# EAGLE design Esquema (EAGLE 9.6.2)
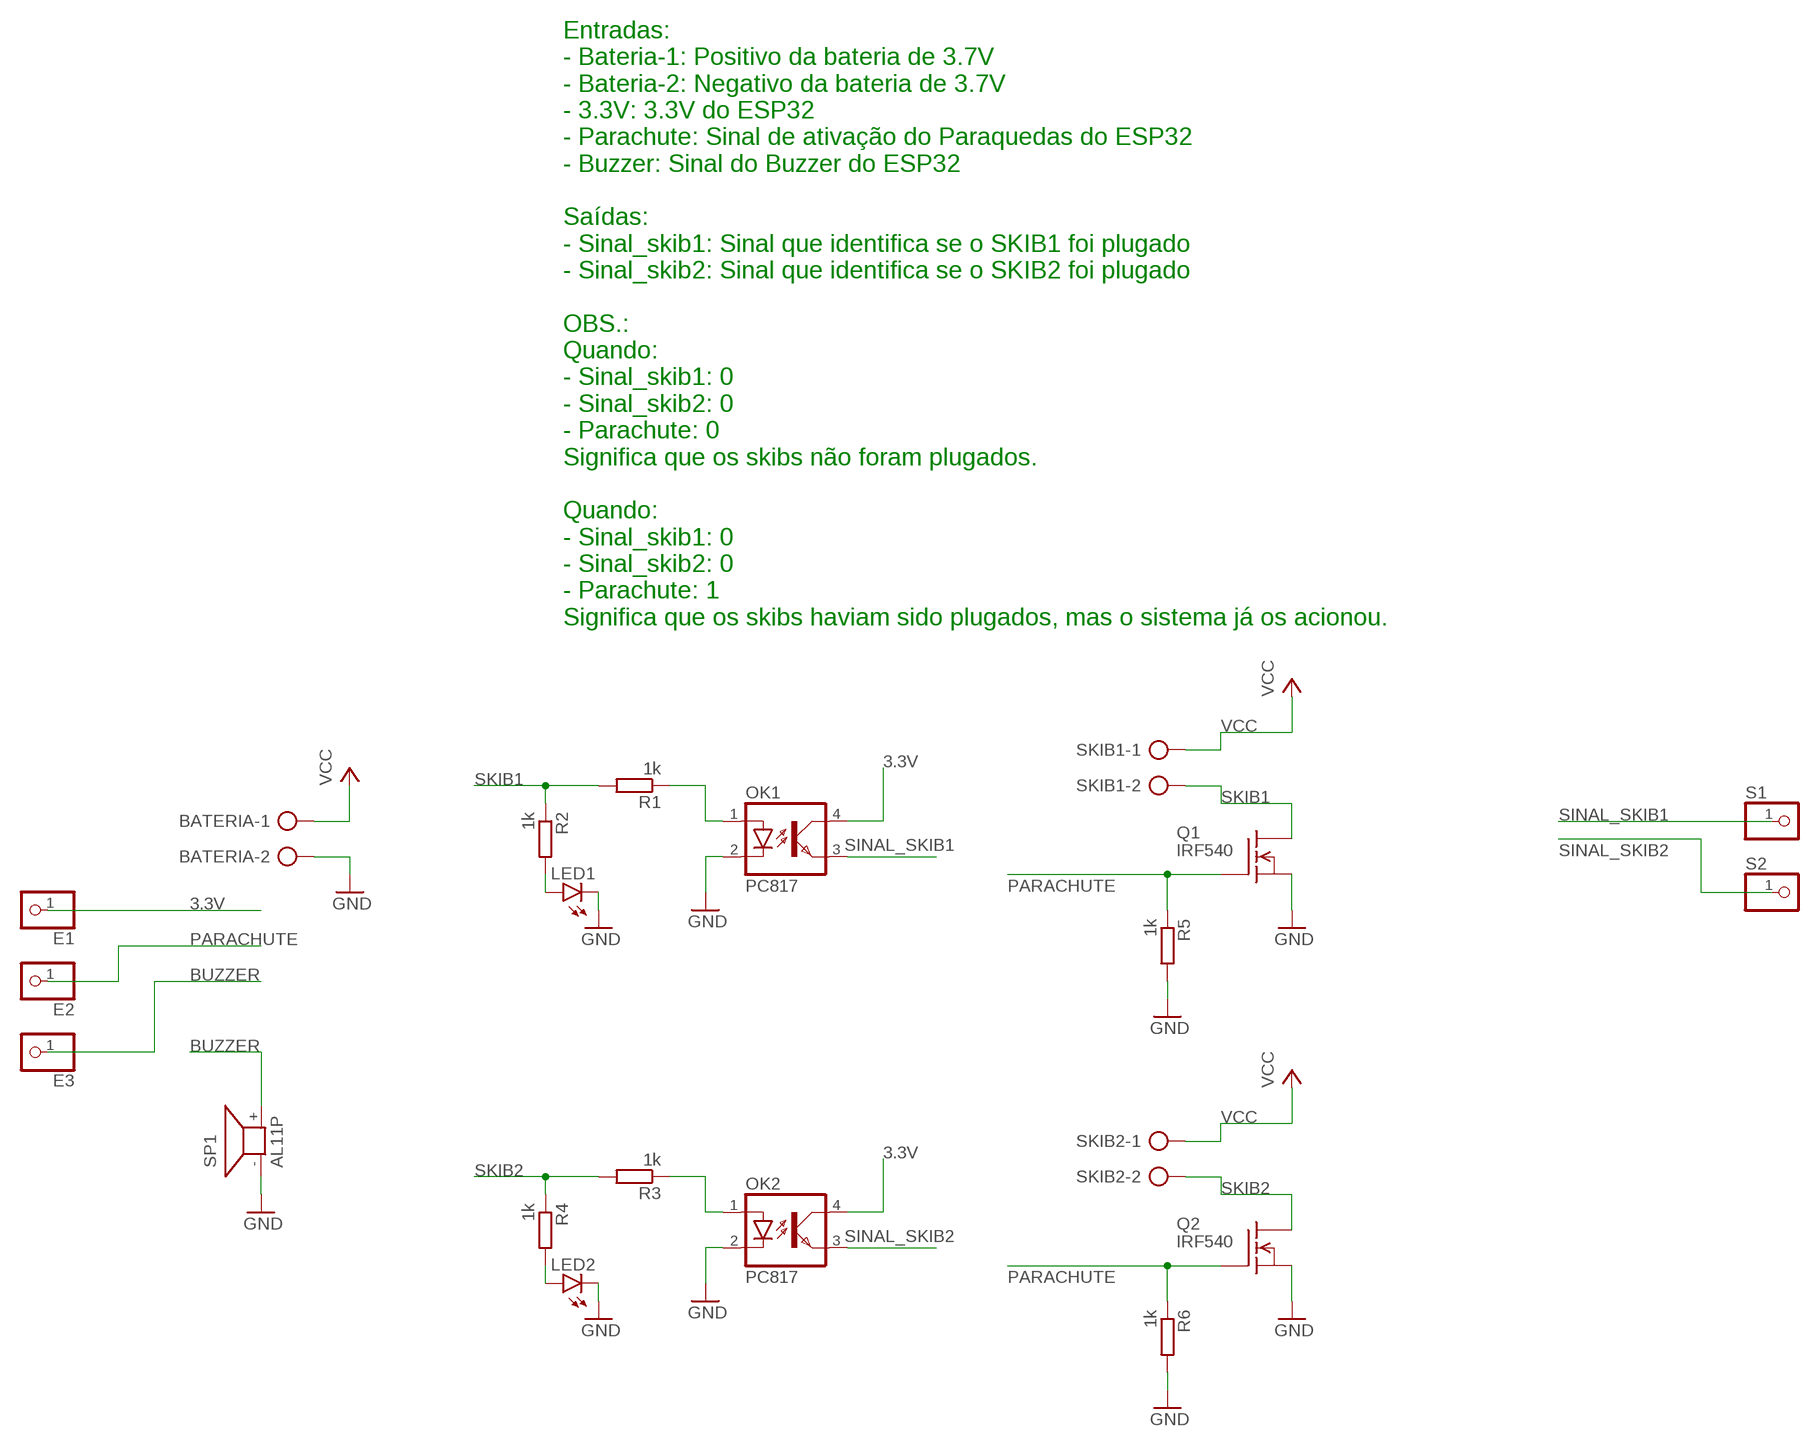
[diagram p0: schematic, sheet 1]

## Parts
BATERIA  AK500/2-H  [AK500/2-H]
E1  PINHD-1X1  [1X01]
E2  PINHD-1X1  [1X01]
E3  PINHD-1X1  [1X01]
LED1  LED5MM  [LED5MM]
LED2  LED5MM  [LED5MM]
OK1  PC817  [DIL04]
OK2  PC817  [DIL04]
Q1  IRF540  [TO220]
Q2  IRF540  [TO220]
R1  1k  R-EU_0207/10  [0207/10]
R2  1k  R-EU_0207/10  [0207/10]
R3  1k  R-EU_0207/10  [0207/10]
R4  1k  R-EU_0207/10  [0207/10]
R5  1k  R-EU_0207/10  [0207/10]
R6  1k  R-EU_0207/10  [0207/10]
S1  PINHD-1X1  [1X01]
S2  PINHD-1X1  [1X01]
SKIB1  AK500/2-H  [AK500/2-H]
SKIB2  AK500/2-H  [AK500/2-H]
SP1  AL11P  [AL11P]

## Nets
3.3V: E1.1 OK1.4(COL) OK2.4(COL)
BUZZER: E3.1 SP1.+
GND: BATERIA.2 LED1.K(C) LED2.K(C) OK1.2(C) OK2.2(C) Q1.3(S) Q2.3(S) R5.2 R6.2 SP1.-
N$1: OK1.1(A) R1.1
N$2: OK2.1(A) R3.1
N$3: LED2.A R4.2
N$4: LED1.A R2.2
PARACHUTE: E2.1 Q1.1(G) Q2.1(G) R5.1 R6.1
SINAL_SKIB1: OK1.3(EMIT) S1.1
SINAL_SKIB2: OK2.3(EMIT) S2.1
SKIB1: Q1.2(D) R1.2 R2.1 SKIB1.2
SKIB2: Q2.2(D) R3.2 R4.1 SKIB2.2
VCC: BATERIA.1 SKIB1.1 SKIB2.1

## Notes on the sheet
- Entradas:
  - Bateria-1: Positivo da bateria de 3.7V
  - Bateria-2: Negativo da bateria de 3.7V
  - 3.3V: 3.3V do ESP32
  - Parachute: Sinal de ativação do Paraquedas do ESP32
  - Buzzer: Sinal do Buzzer do ESP32
  
  Saídas:
  - Sinal_skib1: Sinal que identifica se o SKIB1 foi plugado
  - Sinal_skib2: Sinal que identifica se o SKIB2 foi plugado
  
  OBS.:
  Quando:
  - Sinal_skib1: 0
  - Sinal_skib2: 0
  - Parachute: 0
  Significa que os skibs não foram plugados.
  
  Quando:
  - Sinal_skib1: 0
  - Sinal_skib2: 0
  - Parachute: 1
  Significa que os skibs haviam sido plugados, mas o sistema já os acionou.

## Library data of the parts
BATERIA SKIB1 SKIB2 = con-ptr500:AK500/2-H: CONNECTOR Aug. 2004 / PTR Meßtechnik: Die Bezeichnung der Serie AK505 wurde geändert. Es handelt sich hierbei um AK500 in horizontaler Ausführung.; OC_FARNELL: unknown; OC_NEWARK: unknown
E1-E3 S1 S2 = pinhead:PINHD-1X1: PIN HEADER
LED1 LED2 = led:LED: LED OSRAM: - CHIPLED LG R971, LG N971, LY N971, LG Q971, LY Q971, LO R971, LY R971 LH N974, LH R974 LS Q976, LO Q976, LY Q976 LO Q996 - Hyper CHIPLED LW Q18S LB Q993, LB Q99A, LB R99A - SideLED LS A670, LO A670, LY A670, LG A670, LP A670 LB A673, LV A673, LT A673, LW A673 LH A674 LY A675 LS A676, LA A676, LO A676, LY A676, LW A676 LS A679, LY A679, LG A679 - Hyper Micro SIDELED® LS Y876, LA Y876, LO Y876, LY Y876 LT Y87S - SmartLED LW L88C, LW L88S LB L89C, LB L89S, LG L890 LS L89K, LO L89K, LY L89K LS L896, LA L896, LO L896, LY L896 - TOPLED LS T670, LO T670, LY T670, LG T670, LP T670 LSG T670, LSP T670, LSY T670, LOP T670, LYG T670 LG T671, LOG T671, LSG T671 LB T673, LV T673, LT T673, LW T673 LH T674 LS T676, LA T676, LO T676, LY T676, LB T676, LH T676, LSB T676, LW T676 LB T67C, LV T67C, LT T67C, LS T67K, LO T67K, LY T67K, LW E67C LS E67B, LA E67B, LO E67B, LY E67B, LB E67C, LV E67C, LT E67C LW T67C LS T679, LY T679, LG T679 LS T770, LO T770, LY T770, LG T770, LP T770 LB T773, LV T773, LT T773, LW T773 LH T774 LS E675, LA E675, LY E675, LS T675 LS T776, LA T776, LO T776, LY T776, LB T776 LHGB T686 LT T68C, LB T68C - Hyper Mini TOPLED® LB M676 - Mini TOPLED Santana® LG M470 LS M47K, LO M47K, LY M47K Source: http://www.osram.convergy.de LUXEON: - LUMILED® LXK2-PW12-R00, LXK2-PW12-S00, LXK2-PW14-U00, LXK2-PW14-V00 LXK2-PM12-R00, LXK2-PM12-S00, LXK2-PM14-U00 LXK2-PE12-Q00, LXK2-PE12-R00, LXK2-PE12-S00, LXK2-PE14-T00, LXK2-PE14-U00 LXK2-PB12-K00, LXK2-PB12-L00, LXK2-PB12-M00, LXK2-PB14-N00, LXK2-PB14-P00, LXK2-PB14-Q00 LXK2-PR12-L00, LXK2-PR12-M00, LXK2-PR14-Q00, LXK2-PR14-R00 LXK2-PD12-Q00, LXK2-PD12-R00, LXK2-PD12-S00 LXK2-PH12-R00, LXK2-PH12-S00 LXK2-PL12-P00, LXK2-PL12-Q00, LXK2-PL12-R00 Source: www.luxeon.com KINGBRIGHT: KA-3528ASYC Source: www.kingbright.com
OK1 OK2 = optocoupler:PC817: SHARP OPTO COUPLER; MPN: PC817X4J000F; OC_FARNELL: 9707727; OC_NEWARK: 97K7059
Q1 Q2 = transistor-fet:IRF540: N-Channel Enhancement MOSFET (HEXFET); 100V; 28A; 0,077Ohm
R1-R6 = rcl:R-EU_: RESISTOR, European symbol; SPICEPREFIX: R
SP1 = buzzer:AL11P: SPEAKER Source: Buerklin; OC_FARNELL: unknown; OC_NEWARK: unknown

## Board
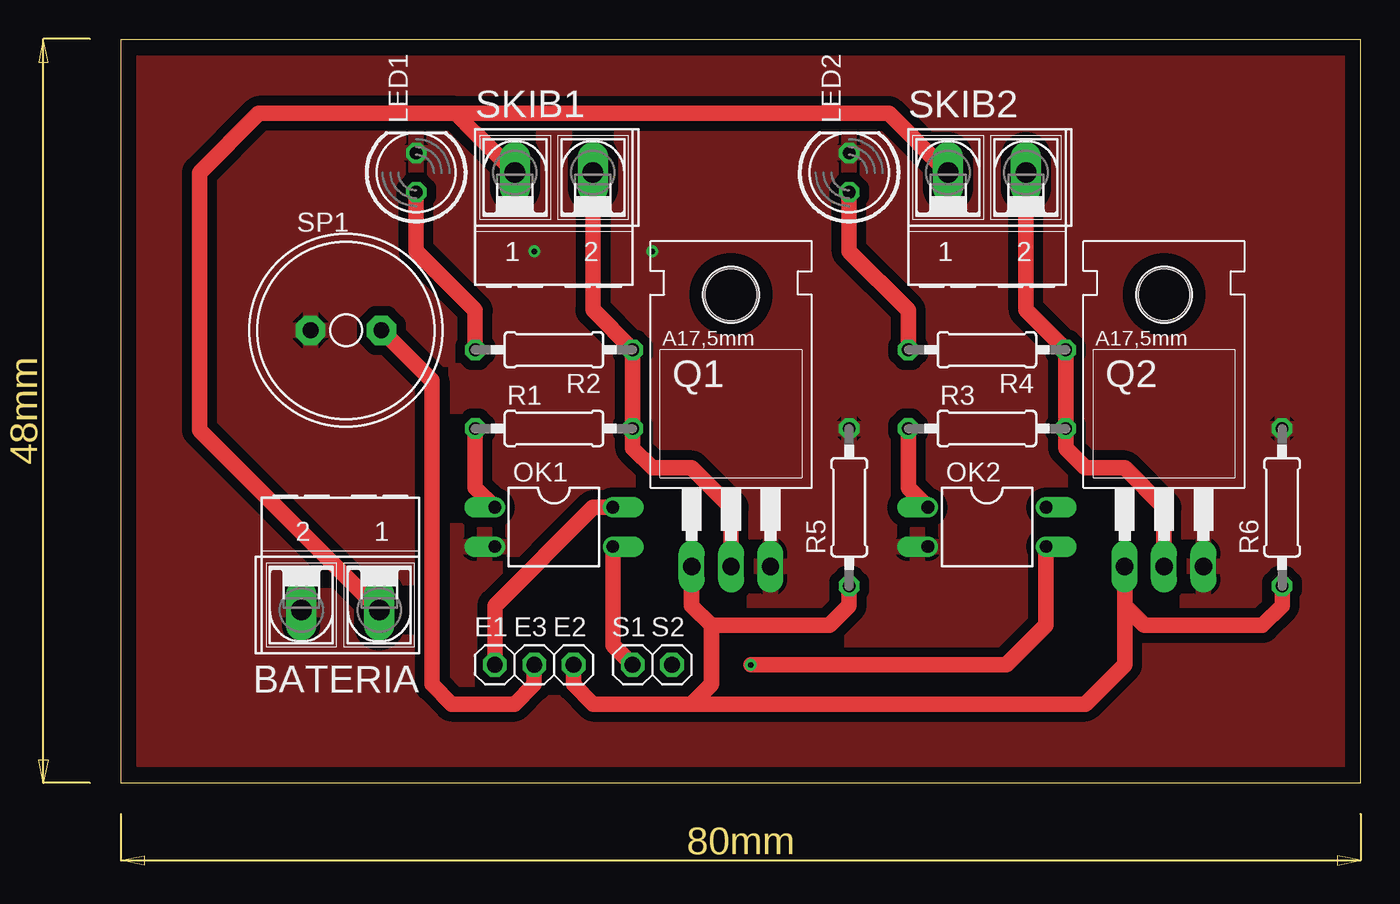
[diagram p1: board, top side]
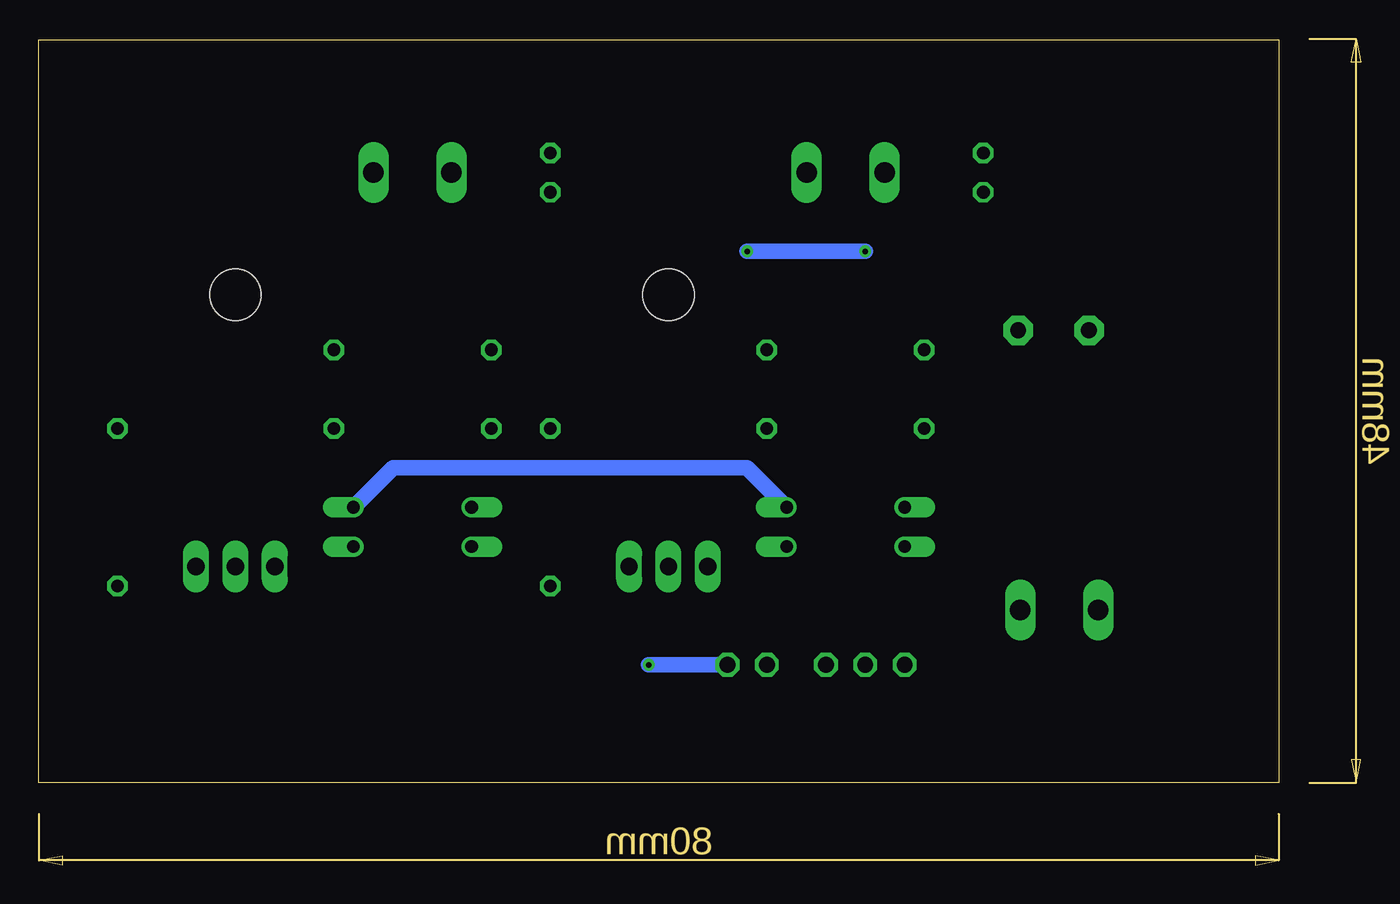
[diagram p2: board, bottom side, seen from below]

Size 79.99 x 47.93 mm. Coordinates in mm from the lower left corner, seen from the top.
Outline: 0,0 79.99,0 79.99,47.93 0,47.93 0,0
Copper layers (1*16): Top 0.035mm / dielectric 1.5mm / Bottom 0.035mm
Design rules "default *": minimum track width 1mm, minimum drill 0.35mm, track to track 25mil, track to pad 0.5mm, pad to pad 6mil, via to via 6mil, smd to smd 6mil, copper to edge 40mil, drill to drill 6mil, minimum pad ring 10mil, minimum via ring 8mil, stop-mask expansion 4mil, vias tented up to drill 0mil, thermal gap 10mil

### Footprints (pad centres in the part's own frame; a part is rotated, then mirrored left to right if it is on the bottom)
AK500/2-H = drill 1.321 long: 1 -2.515,0; 2 2.515,0
1X01 = drill 1.016 octagon: 1 0,0
LED5MM = drill 0.813 octagon: A -1.27,0; K 1.27,0
DIL04 = drill 0.813 offset: 1 -1.27,-3.81; 2 1.27,-3.81; 3 1.27,3.81; 4 -1.27,3.81
TO220 = drill 1.118 long: 1 -2.54,-6.35; 2 0,-6.35; 3 2.54,-6.35 | hole 3.302: 0,11.176
0207/10 = drill 0.813 octagon: 1 -5.08,0; 2 5.08,0
AL11P = drill 1.016 pad 1.905 octagon: + 2.286,0; - -2.286,0

### Placement (x,y rotation side)
BATERIA  14.16,11.16 180 top
E1  24.13,7.62 0 top
E2  29.21,7.62 0 top
E3  26.67,7.62 0 top
LED1  19.05,39.37 90 top
LED2  46.99,39.37 90 top
OK1  27.94,16.51 270 top
OK2  55.88,16.51 270 top
Q1  39.37,20.32 0 top
Q2  67.31,20.32 0 top
R1  27.94,22.86 0 top
R2  27.94,27.94 180 top
R3  55.88,22.86 0 top
R4  55.88,27.94 180 top
R5  46.99,17.78 90 top
R6  74.93,17.78 90 top
S1  33.02,7.62 0 top
S2  35.56,7.62 0 top
SKIB1  27.94,39.37 0 top
SKIB2  55.88,39.37 0 top
SP1  14.53,29.2 0 top

### Tracks (layer width: path | path; a pad name or v marks a point on that pad's centre or on a via)
3.3V
  Top 1: OK1.4 30.48,17.78 24.13,11.43 E1.1
  Bottom 1: OK2.4 57.15,20.32 34.29,20.32 OK1.4
BUZZER
  Top 1: E3.1 26.67,6.35 25.4,5.08 21.34,5.08 20.07,6.35 20.07,25.94 SP1.+
GND  (via drill 0.35)
  Bottom 1: v26.67,34.29 v34.29,34.29
  pour Top: 1.27,46.99 1.27,1.27 78.74,1.27 78.74,46.99
N$1
  Top 1: R1.1 22.86,19.05 OK1.1
N$2
  Top 1: OK2.1 50.8,19.05 R3.1
N$3
  Top 1: R4.2 50.8,30.48 46.99,34.29 LED2.A
N$4
  Top 1: R2.2 22.86,30.48 19.05,34.29 LED1.A
PARACHUTE
  Top 1: Q1.1 36.83,11.43 38.1,10.16 | 38.1,10.16 45.72,10.16 46.99,11.43 R5.1 | E2.1 29.21,6.35 30.48,5.08 36.83,5.08 | 36.83,5.08 38.1,6.35 38.1,10.16 | Q2.1 64.77,11.43 | 64.77,11.43 66.04,10.16 73.66,10.16 74.93,11.43 R6.1 | 36.83,5.08 62.23,5.08 64.77,7.62 64.77,11.43
SINAL_SKIB1
  Top 1: S1.1 31.75,8.89 OK1.3
SINAL_SKIB2  (via drill 0.35)
  Top 1: OK2.3 59.69,10.16 57.15,7.62 v40.64,7.62
  Bottom 1: S2.1 v40.64,7.62
SKIB1
  Top 1: SKIB1.2 30.45,30.5 R2.1 R1.2 33.02,21.59 34.29,20.32 36.83,20.32 39.37,17.78 Q1.2
SKIB2
  Top 1: Q2.2 67.31,17.78 64.77,20.32 62.23,20.32 60.96,21.59 R3.2 R4.1 58.4,30.5 SKIB2.2
VCC
  Top 1: SKIB1.1 22.89,41.91 22.86,41.91 21.59,43.18 | SKIB2.1 49.55,43.18 21.59,43.18 | 21.59,43.18 8.89,43.18 5.08,39.37 5.08,22.75 BATERIA.1